# EAGLE design Final (EAGLE 9.2.2)
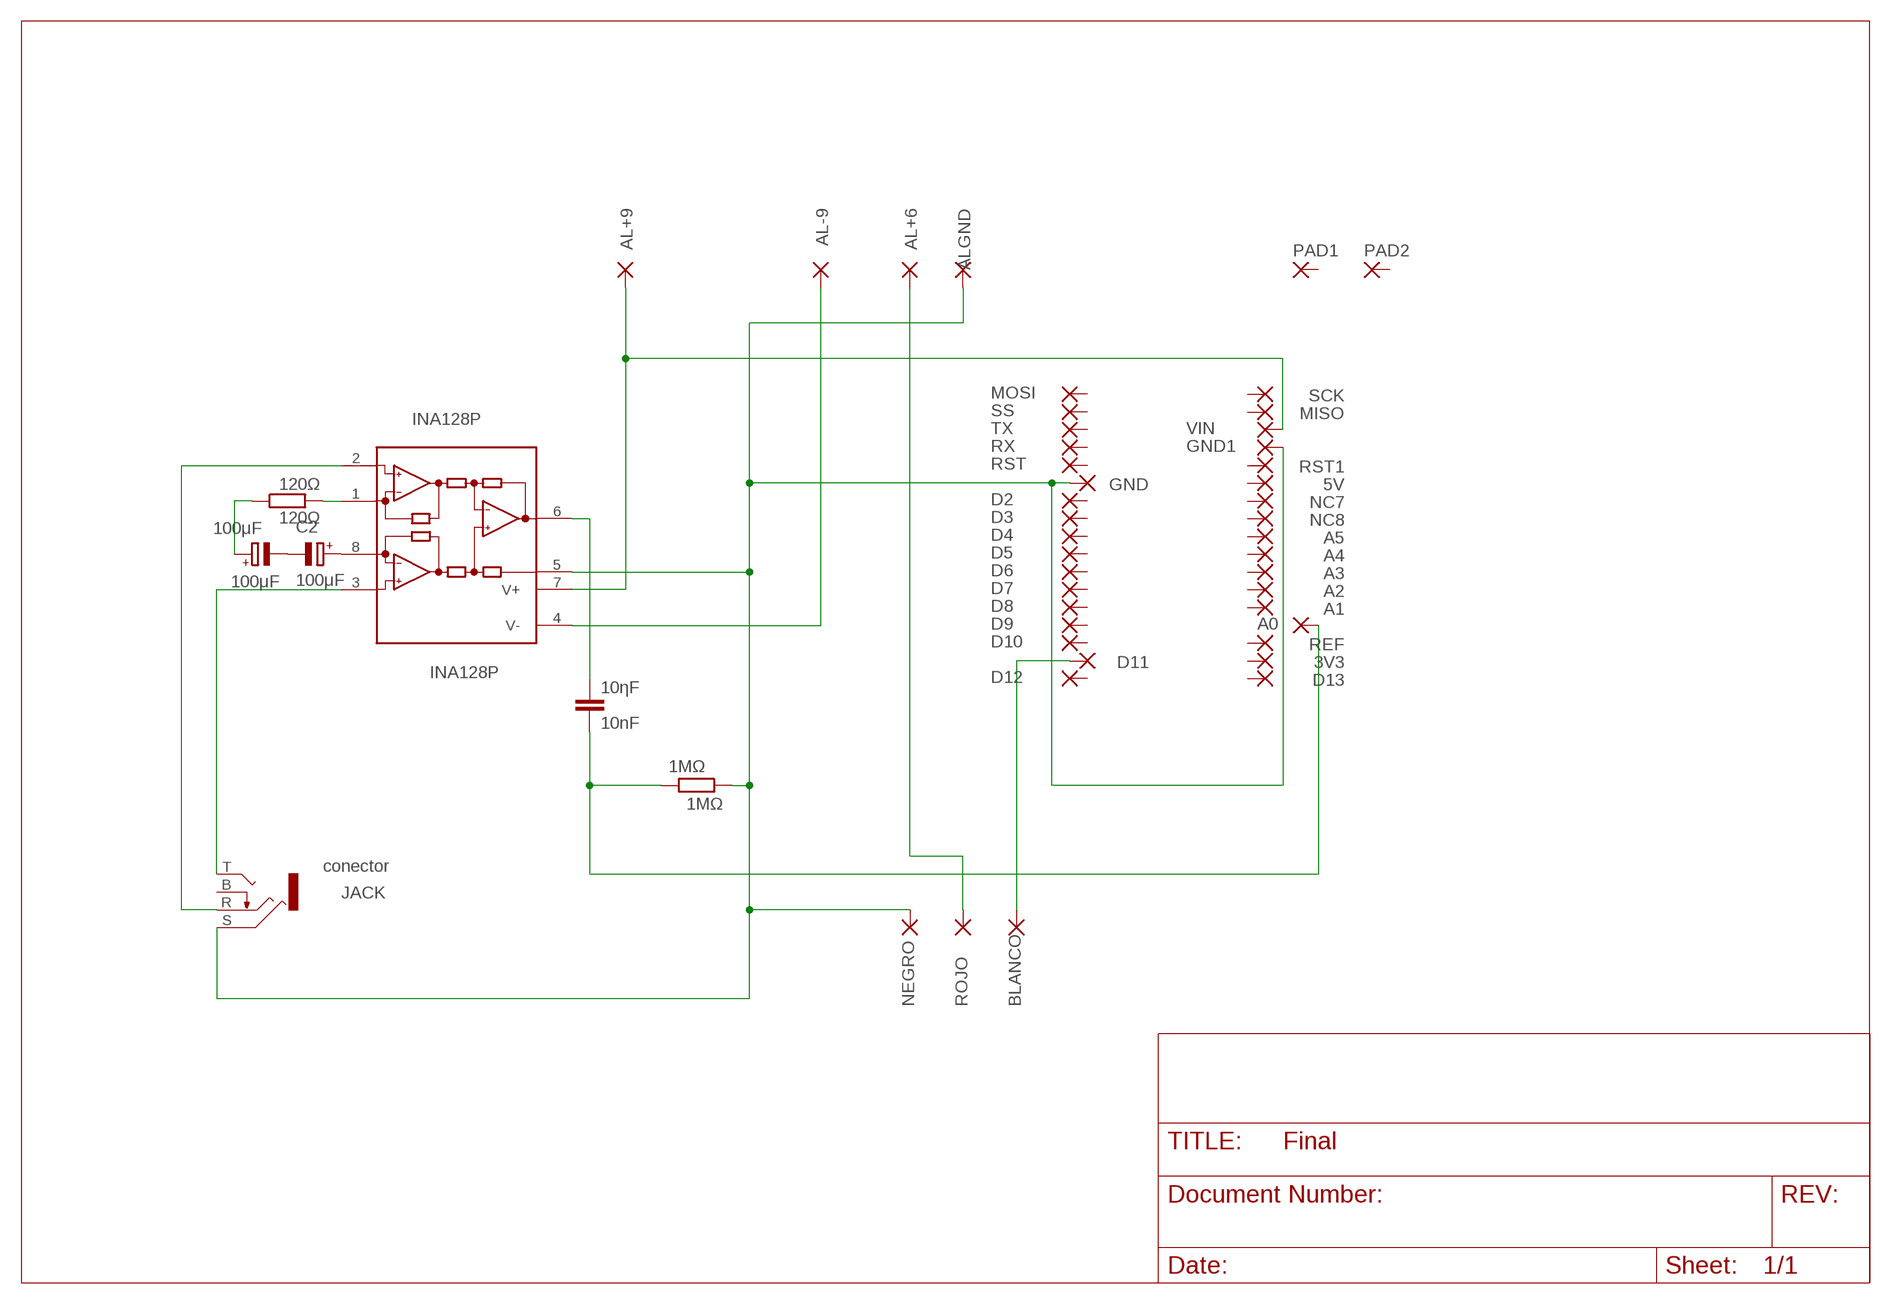
[diagram p0: schematic, sheet 1]

## Parts
1MΩ  1MΩ  R-EU_0207/15  [0207/15]
3V3  1,6/0,9  [1,6/0,9]
5V  1,6/0,9  [1,6/0,9]
10ηF  10nF  C-EU050-030X075  [C050-030X075]
100μF  100μF  CPOL-EUB45181B  [B45181B]
120Ω  120Ω  R-EU_0207/15  [0207/15]
A0  1,6/0,9  [1,6/0,9]
A1  1,6/0,9  [1,6/0,9]
A2  1,6/0,9  [1,6/0,9]
A3  1,6/0,9  [1,6/0,9]
A4  1,6/0,9  [1,6/0,9]
A5  1,6/0,9  [1,6/0,9]
AL+6  1,6/0,9  [1,6/0,9]
AL+9  1,6/0,9  [1,6/0,9]
AL-9  1,6/0,9  [1,6/0,9]
ALGND  1,6/0,9  [1,6/0,9]
BLANCO  1,6/0,9  [1,6/0,9]
C2  100μF  CPOL-EUB45181B  [B45181B]
D2  1,6/0,9  [1,6/0,9]
D3  1,6/0,9  [1,6/0,9]
D4  1,6/0,9  [1,6/0,9]
D5  1,6/0,9  [1,6/0,9]
D6  1,6/0,9  [1,6/0,9]
D7  1,6/0,9  [1,6/0,9]
D8  1,6/0,9  [1,6/0,9]
D9  1,6/0,9  [1,6/0,9]
D10  1,6/0,9  [1,6/0,9]
D11  1,6/0,9  [1,6/0,9]
D12  1,6/0,9  [1,6/0,9]
D13  1,6/0,9  [1,6/0,9]
GND  1,6/0,9  [1,6/0,9]
GND1  1,6/0,9  [1,6/0,9]
INA128P  INA128P  [DIL08]
JACK  conector  KLBR4  [KLBR4]
MISO  1,6/0,9  [1,6/0,9]
MOSI  1,6/0,9  [1,6/0,9]
NC7  1,6/0,9  [1,6/0,9]
NC8  1,6/0,9  [1,6/0,9]
NEGRO  1,6/0,9  [1,6/0,9]
PAD1  3,81/1,4  [3,81/1,4]
PAD2  3,81/1,4  [3,81/1,4]
REF  1,6/0,9  [1,6/0,9]
ROJO  1,6/0,9  [1,6/0,9]
RST  1,6/0,9  [1,6/0,9]
RST1  1,6/0,9  [1,6/0,9]
RX  1,6/0,9  [1,6/0,9]
SCK  1,6/0,9  [1,6/0,9]
SS  1,6/0,9  [1,6/0,9]
TX  1,6/0,9  [1,6/0,9]
VIN  1,6/0,9  [1,6/0,9]

## Nets
+6VCC: AL+6.1(P) ROJO.1(P)
+9VCC: AL+9.1(P) INA128P.7(V+) VIN.1(P)
-9VCC: AL-9.1(P) INA128P.4(V-)
A0: 1MΩ.2 10ηF.2 A0.1(P)
CONTROL_SERVO: BLANCO.1(P) D11.1(P)
E1: INA128P.2(-IN) JACK.R
E2: INA128P.3(+IN) JACK.T
GND: 1MΩ.1 ALGND.1(P) GND1.1(P) GND.1(P) INA128P.5(REF) JACK.S NEGRO.1(P)
N$1: C2.+ INA128P.8(RG)
N$2: 100μF.- C2.-
N$3: 120Ω.2 INA128P.1(RG)
N$4: 100μF.+ 120Ω.1
N$5: 10ηF.1 INA128P.6(OUT)
Unconnected: 3V3.1(P) 5V.1(P) A1.1(P) A2.1(P) A3.1(P) A4.1(P) A5.1(P) D2.1(P) D3.1(P) D4.1(P) D5.1(P) D6.1(P) D7.1(P) D8.1(P) D9.1(P) D10.1(P) D12.1(P) D13.1(P) JACK.B MISO.1(P) MOSI.1(P) NC7.1(P) NC8.1(P) PAD1.1(P) PAD2.1(P) REF.1(P) RST1.1(P) RST.1(P) RX.1(P) SCK.1(P) SS.1(P) TX.1(P)

## Library data of the parts
1MΩ 120Ω = rcl:R-EU_: RESISTOR, European symbol; SPICEPREFIX: R
3V3 5V A0 A1-A5 AL+6 AL+9 AL-9 ALGND BLANCO D2-D13 GND GND1 MISO MOSI NC7 NC8 NEGRO REF ROJO RST RST1 RX SCK SS TX VIN = wirepad:1,6/0,9: THROUGH-HOLE PAD
10ηF = rcl:C-EU: CAPACITOR, European symbol; SPICEPREFIX: C
100μF C2 = rcl:CPOL-EU: POLARIZED CAPACITOR, European symbol; SPICEPREFIX: C
INA128P = burr-brown:INA128: Instrumentation Amplifiers Precision, Low Power; MF: TEXAS INSTRUMENTS; MPN: INA128P; OC_FARNELL: 1212410; OC_NEWARK: 74C9783
JACK = con-lumberg:KLBR4: Jack connectors according to JISC 6560, 3.5 mm Klinkeneinbaukupplung nach JISC 6560, 3,5 mm, 3-polig/ stereo, abgewinkelte Ausführung, mit Öffner, für Leiterplatten Source: Data sheet <http://www.lumberg.com/Produkte/PDFs/KLBR4.pdf>; MPN: KLBR 4; OC_FARNELL: 1217016; OC_NEWARK: 97K2709
PAD1 PAD2 = wirepad:3,81/1,4: THROUGH-HOLE PAD

## Board
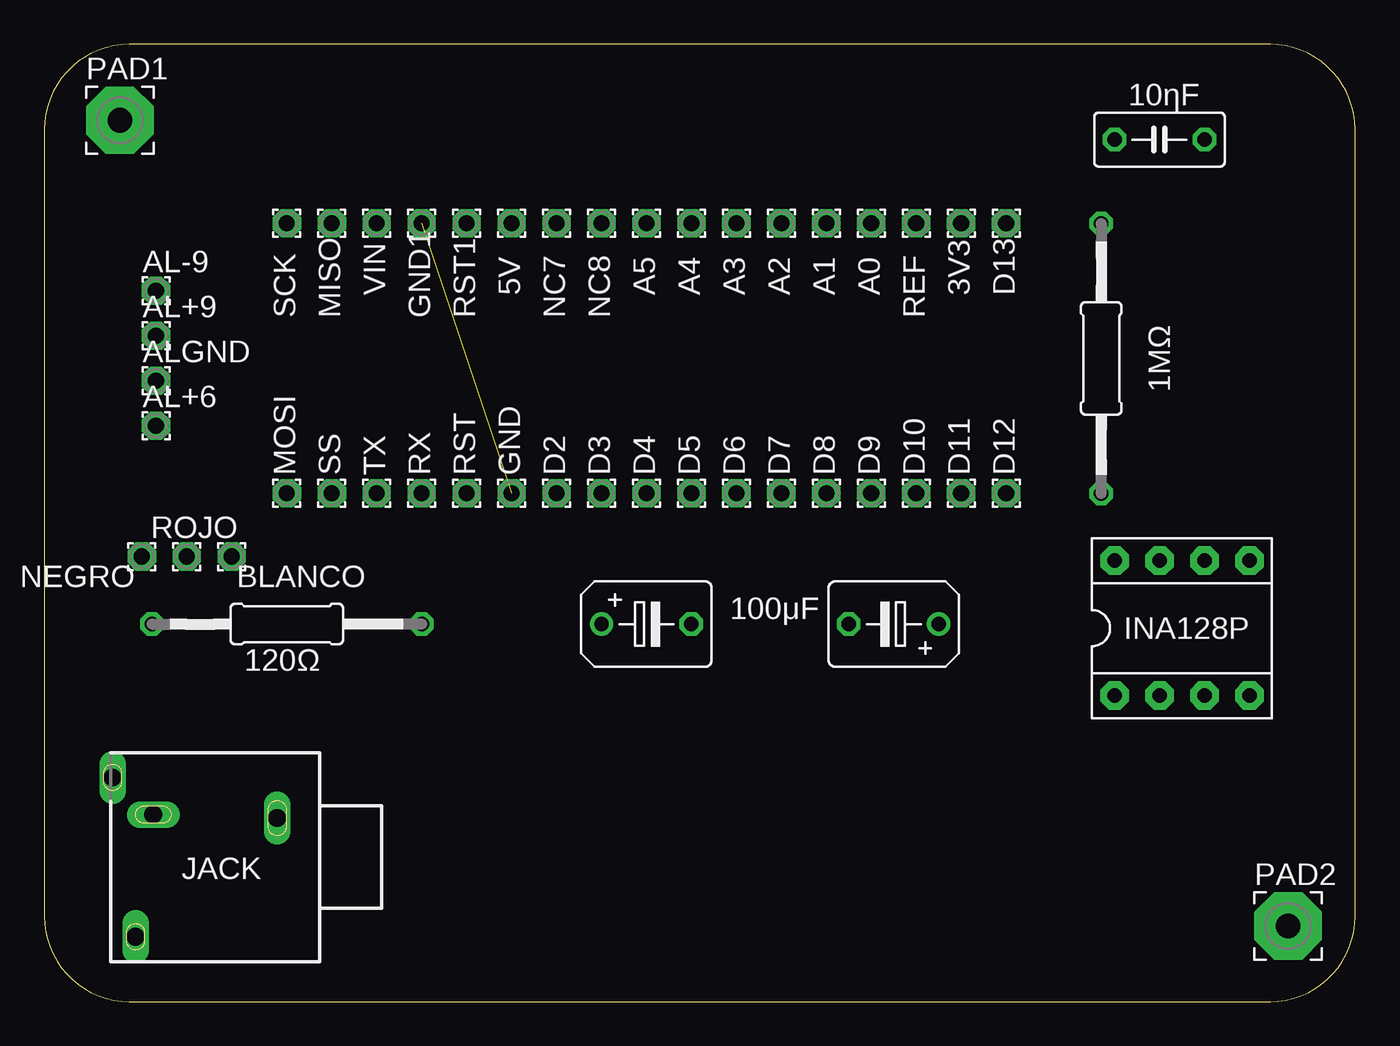
[diagram p1: board, top side]
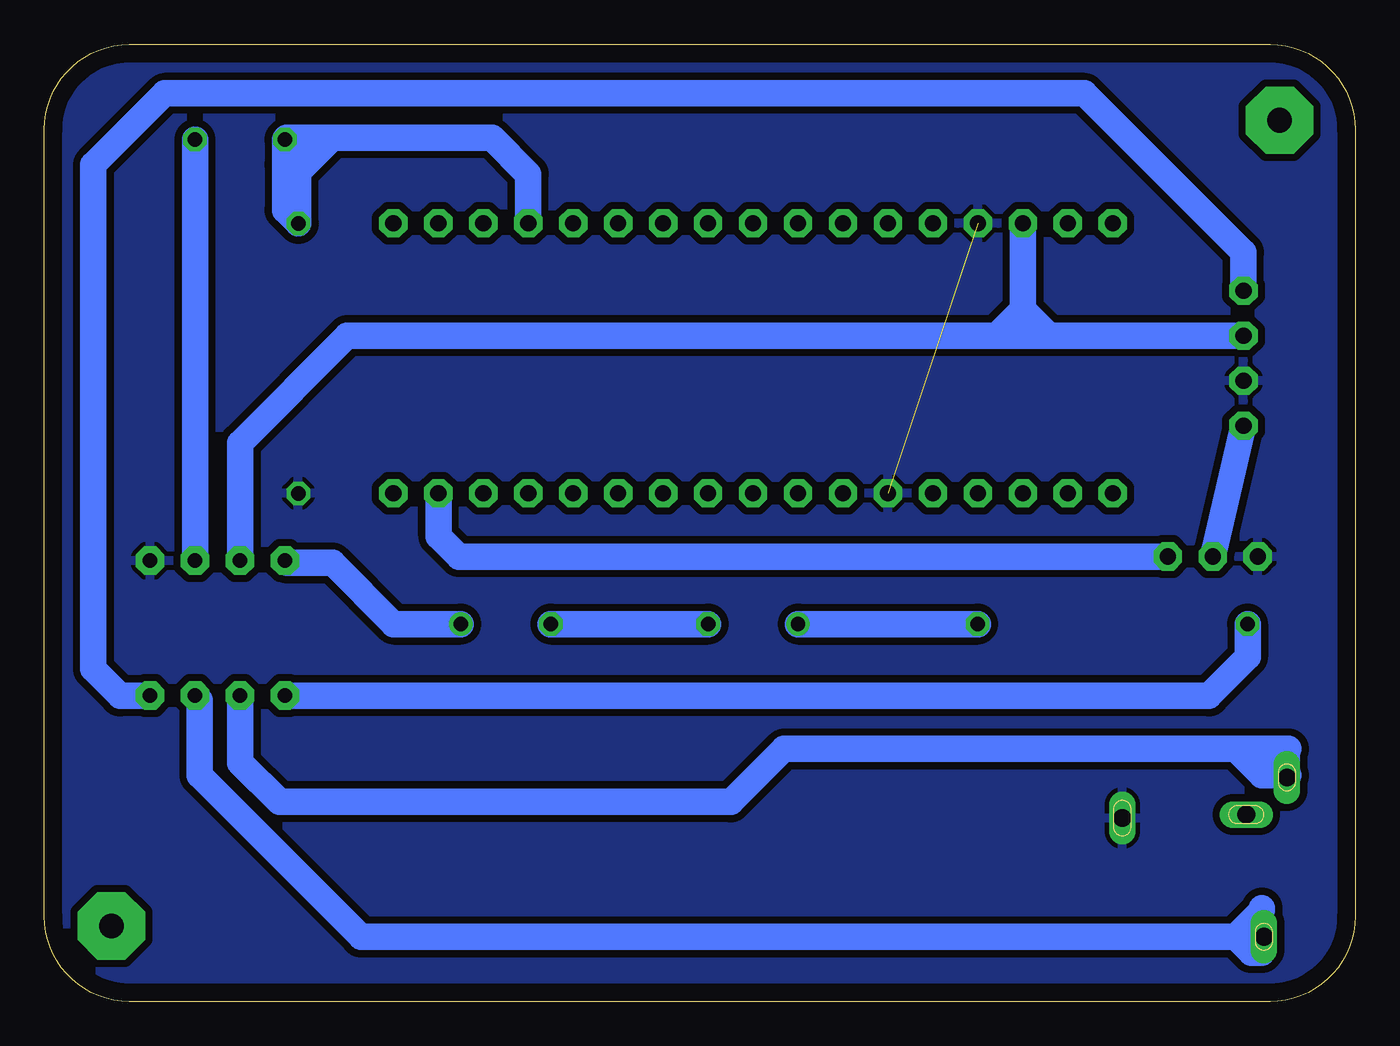
[diagram p2: board, bottom side, seen from below]

Size 74.06 x 54.06 mm. Coordinates in mm from the lower left corner, seen from the top.
Outline: 0,49.25 0,4.81 arc90 4.81,0 69.25,0 arc90 74.06,4.81 74.06,49.25 arc90 69.25,54.06 4.81,54.06 arc90 0,49.25
Copper layers (1*16): Top 0.035mm / dielectric 1.5mm / Bottom 0.035mm
Design rules "default": minimum track width 6mil, minimum drill 0.35mm, track to track 6mil, track to pad 6mil, pad to pad 6mil, via to via 6mil, smd to smd 6mil, copper to edge 40mil, drill to drill 6mil, minimum pad ring 10mil, minimum via ring 8mil, stop-mask expansion 4mil, vias tented up to drill 0mil, thermal gap 10mil

### Footprints (pad centres in the part's own frame; a part is rotated, then mirrored left to right if it is on the bottom)
0207/15 = drill 0.813 octagon: 1 -7.62,0; 2 7.62,0
1,6/0,9 = drill 0.914 pad 1.6 octagon: 1 0,0
C050-030X075 = drill 0.813 octagon: 1 -2.54,0; 2 2.54,0
B45181B = drill 0.813: + -2.54,0 | drill 0.813 octagon: - 2.54,0
DIL08 = drill 0.813 pad 1.6 octagon: 1 -3.81,-3.81; 2 -1.27,-3.81; 3 1.27,-3.81; 4 3.81,-3.81; 5 3.81,3.81; 6 1.27,3.81; 7 -1.27,3.81; 8 -3.81,3.81
KLBR4 = drill 1 pad 1.3 long: B -2.4,-3.5; S -2.2,3.5 | drill 1 pad 1.2 long: R -4.5,-5.8; T 4.5,-4.5
3,81/1,4 = drill 1.397 pad 3.81 octagon: 1 0,0

### Placement (x,y rotation side)
1MΩ  59.71,36.32 90 top
3V3  51.8,43.95 0 top
5V  26.4,43.95 0 top
10ηF  63,48.68 180 top
100μF  34.02,21.32 0 top
120Ω  13.7,21.32 180 top
A0  46.72,43.95 0 top
A1  44.18,43.95 0 top
A2  41.64,43.95 0 top
A3  39.1,43.95 0 top
A4  36.56,43.95 0 top
A5  34.02,43.95 0 top
AL+6  6.31,32.52 0 top
AL+9  6.31,37.6 0 top
AL-9  6.31,40.14 0 top
ALGND  6.31,35.06 0 top
BLANCO  10.59,25.13 0 top
C2  47.99,21.32 180 top
D2  28.94,28.71 0 top
D3  31.48,28.71 0 top
D4  34.02,28.71 0 top
D5  36.56,28.71 0 top
D6  39.1,28.71 0 top
D7  41.64,28.71 0 top
D8  44.18,28.71 0 top
D9  46.72,28.71 0 top
D10  49.26,28.71 0 top
D11  51.8,28.71 0 top
D12  54.34,28.71 0 top
D13  54.34,43.95 0 top
GND  26.4,28.71 0 top
GND1  21.32,43.95 0 top
INA128P  64.27,21.09 0 top
JACK  9.66,8.16 270 top
MISO  16.24,43.95 0 top
MOSI  13.7,28.71 0 top
NC7  28.94,43.95 0 top
NC8  31.48,43.95 0 top
NEGRO  5.51,25.13 0 top
PAD1  4.27,49.77 0 top
PAD2  70.27,4.27 0 top
REF  49.26,43.95 0 top
ROJO  8.05,25.13 0 top
RST  23.86,28.71 0 top
RST1  23.86,43.95 0 top
RX  21.32,28.71 0 top
SCK  13.7,43.95 0 top
SS  16.24,28.71 0 top
TX  18.78,28.71 0 top
VIN  18.78,43.95 0 top

### Tracks (layer width: path | path; a pad name or v marks a point on that pad's centre or on a via)
+6VCC
  Bottom 1.5: AL+6.1 ROJO.1
+9VCC
  Bottom 1.5: AL+9.1 17.27,37.6 | 17.27,37.6 18.77,37.6 | 18.77,37.6 20.27,37.6 | 20.27,37.6 56.94,37.6 63,31.54 INA128P.7 | VIN.1 18.77,39.1 | 18.77,39.1 18.77,37.6 | 17.27,37.6 18.77,39.1 | 20.27,37.6 18.77,39.1
-9VCC
  Bottom 1.5: INA128P.4 69.77,17.27 71.29,18.79 71.29,47.25 67.25,51.29 15.29,51.29 6.31,42.31 AL-9.1
A0
  Bottom 1.5: 57.77,48.77 48.77,48.77 46.72,46.72 A0.1 | 57.77,48.77 59.27,48.77 | 59.27,48.77 60.37,48.77 10ηF.2 60.46,47.27 | 60.46,47.27 60.46,44.69 1MΩ.2 59.71,46.83 | 59.27,48.77 59.27,48.46 59.71,48.02 | 59.71,48.02 60.46,47.27 | 59.71,46.83 59.71,48.02 | 59.71,46.83 57.77,48.77
CONTROL_SERVO
  Bottom 1.5: D11.1 51.77,28.68 51.77,26.27 50.63,25.13 BLANCO.1
E1
  Bottom 1.5: INA128P.2 63,13.5 60.77,11.27 35.27,11.27 32.27,14.27 6.77,14.27 | JACK.R 3.86,14.18 3.77,14.27 6.77,14.27 | 6.77,14.27 5.27,12.77 3.77,12.77
E2
  Bottom 1.5: 5.27,5.27 5.27,5.16 6.77,3.66 | JACK.T 5.27,3.55 5.27,2.77 5.88,2.77 6.77,3.66 | INA128P.3 65.27,17.01 65.27,12.77 56.16,3.66 6.77,3.66
GND  (1 unrouted)
  pour Bottom (isolate 0.406): 0,54.07 73.89,54.07 73.89,0 0,0
N$1
  Bottom 1.5: INA128P.8 60.33,24.77 57.77,24.77 54.32,21.32 C2.+
N$2
  Bottom 1.5: C2.- 100μF.-
N$3
  Bottom 1.5: 120Ω.2 6.08,19.46 8.27,17.27 INA128P.1
N$4
  Bottom 1.5: 100μF.+ 120Ω.1
N$5
  Bottom 1.5: INA128P.6 10ηF.1